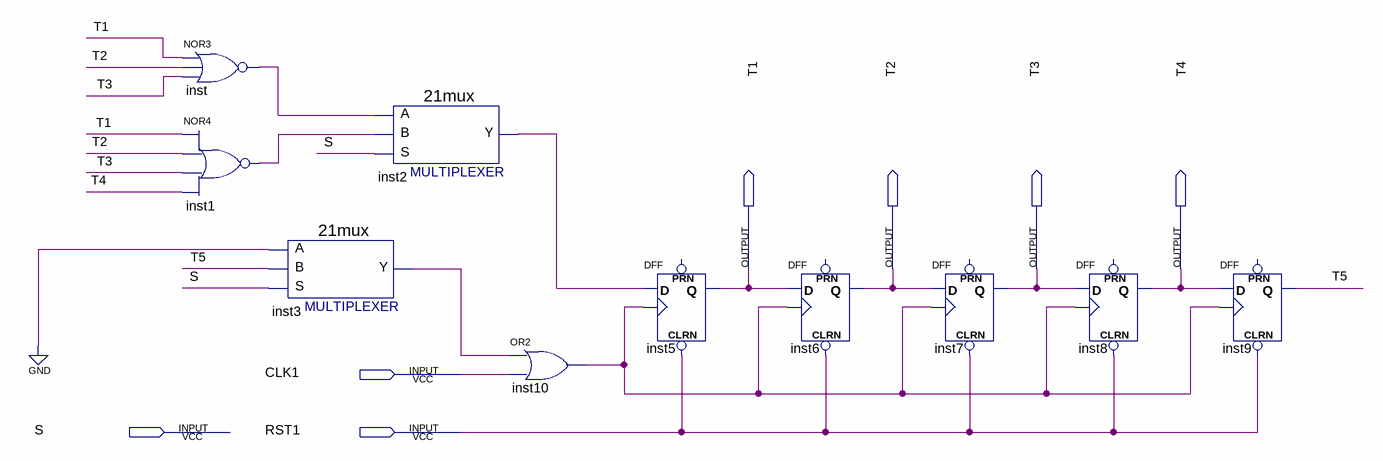
[diagram p0: schematic sheet]
// Quartus schematic SEQUENCE.bdf as structural Verilog: 10 symbols, 7 pins
module SEQUENCE (
  input  CLK1,
  input  S,
  input  RST1,
  output T1,
  output T2,
  output T3,
  output T4
);

  wire inst1_out, inst2_y, inst3_y, inst10_out, inst_out, T5;

  nor inst (inst_out, T1, T2, T3);
  nor inst1 (inst1_out, T1, T2, T3, T4);
  \21mux  inst3 (.S(S), .B(T5), .A(1'b0), .Y(inst3_y));
  \21mux  inst2 (.S(S), .B(inst1_out), .A(inst_out), .Y(inst2_y));
  or inst10 (inst10_out, inst3_y, CLK1);
  DFF inst5 (.CLRN(RST1), .CLK(inst10_out), .D(inst2_y), .Q(T1));  // open: PRN
  DFF inst6 (.CLRN(RST1), .CLK(inst10_out), .D(T1), .Q(T2));  // open: PRN
  DFF inst7 (.CLRN(RST1), .CLK(inst10_out), .D(T2), .Q(T3));  // open: PRN
  DFF inst8 (.CLRN(RST1), .CLK(inst10_out), .D(T3), .Q(T4));  // open: PRN
  DFF inst9 (.CLRN(RST1), .CLK(inst10_out), .D(T4), .Q(T5));  // open: PRN
endmodule
